# Altium schematic sheet gokart_top.SchDoc: Go Kart Control Board
size A4; Revision: 0.1
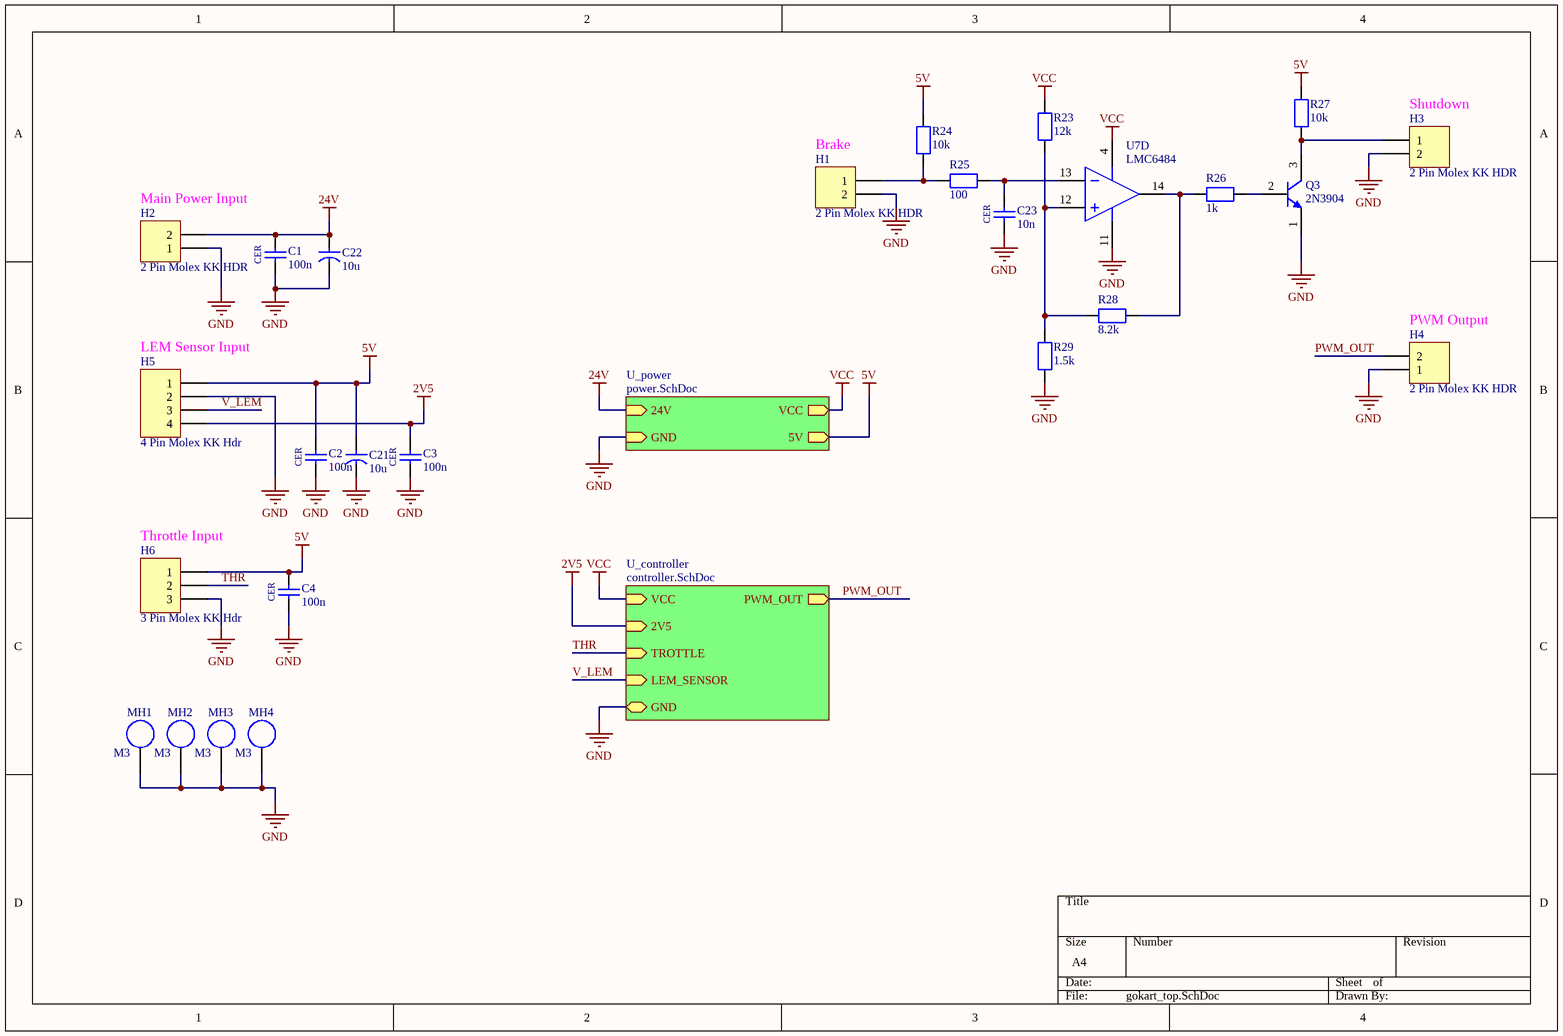
[diagram p0: gokart_top.SchDoc]

## Parts
C1  100n  [CAP_CER_2.50]
C2  100n  [CAP_CER_2.50]
C3  100n  [CAP_CER_2.50]
C4  100n  [CAP_CER_2.50]
C21  10u  [CAP_ELEC_2.50]
C22  10u  [CAP_ELEC_2.50]
C23  10n  [CAP_CER_2.50]
H1  2 Pin Molex KK HDR  [MOLEX_KK_2_HDR]
H2  2 Pin Molex KK HDR  [MOLEX_KK_2_HDR]
H3  2 Pin Molex KK HDR  [MOLEX_KK_2_HDR]
H4  2 Pin Molex KK HDR  [MOLEX_KK_2_HDR]
H5  4 Pin Molex KK Hdr  [MOLEX_KK_4_HDR]
H6  3 Pin Molex KK Hdr  [MOLEX_KK_3_HDR]
MH1  M3  [M3-Mounting-Hole]
MH2  M3  [M3-Mounting-Hole]
MH3  M3  [M3-Mounting-Hole]
MH4  M3  [M3-Mounting-Hole]
Q3  2N3904  [ONSC-TO-92-3-29-04_AD]
R23  12k  [RESISTOR_THROUGH_HOLE]
R24  10k  [RESISTOR_THROUGH_HOLE]
R25  100  [RESISTOR_THROUGH_HOLE]
R26  1k  [RESISTOR_THROUGH_HOLE]
R27  10k  [RESISTOR_THROUGH_HOLE]
R28  8.2k  [RESISTOR_THROUGH_HOLE]
R29  1.5k  [RESISTOR_THROUGH_HOLE]
U7  LMC6484  [TI-J14]  (part D of 4)

## Sub-sheets
U_controller = controller.SchDoc: TROTTLE (in), LEM_SENSOR (in), VCC (in), 2V5 (in), PWM_OUT (out), GND (bidir)
U_power = power.SchDoc: 24V (in), GND (in), VCC (out), 5V (out)

## Nets
2V5: C3.2 H5.4 ; sheet U_controller/2V5
5V: C2.2 C4.2 C21.1 H5.1 H6.1 R24.2 R27.2 ; sheet U_power/5V
24V: C1.2 C22.1 H2.2 ; sheet U_power/24V
GND: C1.1 C2.1 C3.1 C4.1 C21.2 C22.2 C23.1 H1.2 H2.1 H3.2 H4.1 H5.2 H6.3 MH1.1 MH2.1 MH3.1 MH4.1 Q3.1(E) R29.1 U7.11(VCC-) ; sheet U_power/GND, sheet U_controller/GND
VCC: R23.2 U7.4(VCC+) ; sheet U_power/VCC, sheet U_controller/VCC
PWM_OUT: H4.2 ; sheet U_controller/PWM_OUT
THR: H6.2 ; sheet U_controller/TROTTLE
V_LEM: H5.3 ; sheet U_controller/LEM_SENSOR
NetC23_2: C23.2 R25.2 U7.13(IN4-)
NetH1_1: H1.1 R24.1 R25.1
NetH3_1: H3.1 Q3.3(C) R27.1
NetQ3_2: Q3.2(B) R26.1
NetR23_1: R23.1 R28.1 R29.2 U7.12(IN4+)
NetR26_2: R26.2 R28.2 U7.14(OUT4)

## Notes on the sheet
- (near H3) Shutdown
- (near H1) Brake
- Main Power Input
- (near H5) LEM Sensor Input
- (near H4) PWM Output
- (near H6) Throttle Input
- (in symbol CAP_CER) CER

## Library data of the parts
C1-C4 C23 = CAP_CER: Value: F
C21 = CAP_ELEC: Value: F
C22 = CAP_ELEC: Value: 10u
H1-H4 = JA_MOLEX_KK_2POS: CONN HEADER 2POS 2.54mm VERT_Thru Hole; Supplier 1: Farnell; Supplier Part Number 1: 1462926; Supplier: ECE Dept; Storage Location: ECE Dept Store; Value: 2 Pin Molex KK HDR
H5 = JA_MOLEX_KK_4POS: CONN HEADER 4POS 2.54mm VERT_Thru Hole; Manufacturer: Molex; Manufacturer PN: 22-23-2041; Supplier Part Number 1: 9731164; Supplier: ECE Dept; Supplier 1: Farnell; Storage Location: ECE Dept Store; Value: 4 Pin Molex KK Hdr
H6 = JA_MOLEX_KK_3POS: CONN HEADER 3POS 2.54mm VERT_Thru Hole; Manufacturer: Molex; Manufacturer PN: 22-23-2031; Supplier Part Number 1: 9731156; Supplier: ECE Dept; Supplier 1: Farnell; Storage Location: ECE Dept Store; Value: 3 Pin Molex KK Hdr
MH1-MH4 = M3-Mounting-Hole
R23-R29 = Resistor: Value: k
Q3 = 2N3904: ComponentLink1Description: Manufacturer URL; ComponentLink1URL: http://www.onsemi.com/; ComponentLink2Description: Datasheet; ComponentLink2URL: http://www.onsemi.com/pub_link/Collateral/BC549B-D.PDF; ComponentLink3Description: Package Specification; ComponentLink3URL: http://www.onsemi.com/pub_link/Collateral/BC549B-D.PDF
U7 = LMC6484: ComponentLink1Description: Manufacturer URL; ComponentLink1URL: http://www.ti.com/; ComponentLink2Description: Datasheet; ComponentLink2URL: http://www.ti.com/lit/ds/symlink/tl064m.pdf; ComponentLink3Description: Package Specification; ComponentLink3URL: http://www.ti.com/litv/pdf/mcer002d